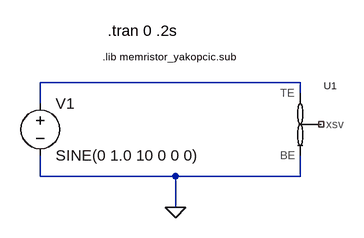
[diagram p0: schematic memristor_yakopcic_sim.asc]
memristor_yakopcic_sim.asc, the LTspice schematic file:
Version 4
SHEET 1 880 680
WIRE 416 0 16 0
WIRE 416 16 416 0
WIRE 16 32 16 0
WIRE 16 144 16 112
WIRE 224 144 16 144
WIRE 416 144 416 112
WIRE 416 144 224 144
WIRE 224 192 224 144
FLAG 224 192 0
SYMBOL voltage 16 16 R0
WINDOW 123 0 0 Left 2
WINDOW 39 0 0 Left 2
SYMATTR InstName V1
SYMATTR Value SINE(0 1.0 10 0 0 0)
SYMBOL memristor_with_state 416 64 R0
SYMATTR InstName U1
SYMATTR Value MEM_YAKOPCIC
TEXT 120 -80 Left 2 !.tran 0 .2s
TEXT 112 -40 Left 1 !.lib memristor_yakopcic.sub

The netlist it stands for:
* memristor_yakopcic_sim.asc
V1 N001 0 SINE(0 1.0 10 0 0 0)
XU1 N001 0 NC_01 MEM_YAKOPCIC  ; pins TE BE xsv
.tran 0 .2s
.lib memristor_yakopcic.sub
.backanno
.end